# EasyEDA Pro project ProPrj_AUCompetition.epro, schematic 扩展板

## Sheets
1 P1: Assembly Variant: Basic; Board Name: Board1; Create Date: 2026-05-09; Page Name: P1; Project Name: 21届智控大赛; Schematic Name: Schematic1; Update Date: 2026-05-09; BladeWidth: 10; Company: 嘉立创EDA; Page Size: A4; RegionStart: 1; ShowBorder: 1; TitleBlock: 1; TitleBlockPosition: 3; Version: V1.0; XRegionCount: 6; YRegionCount: 4
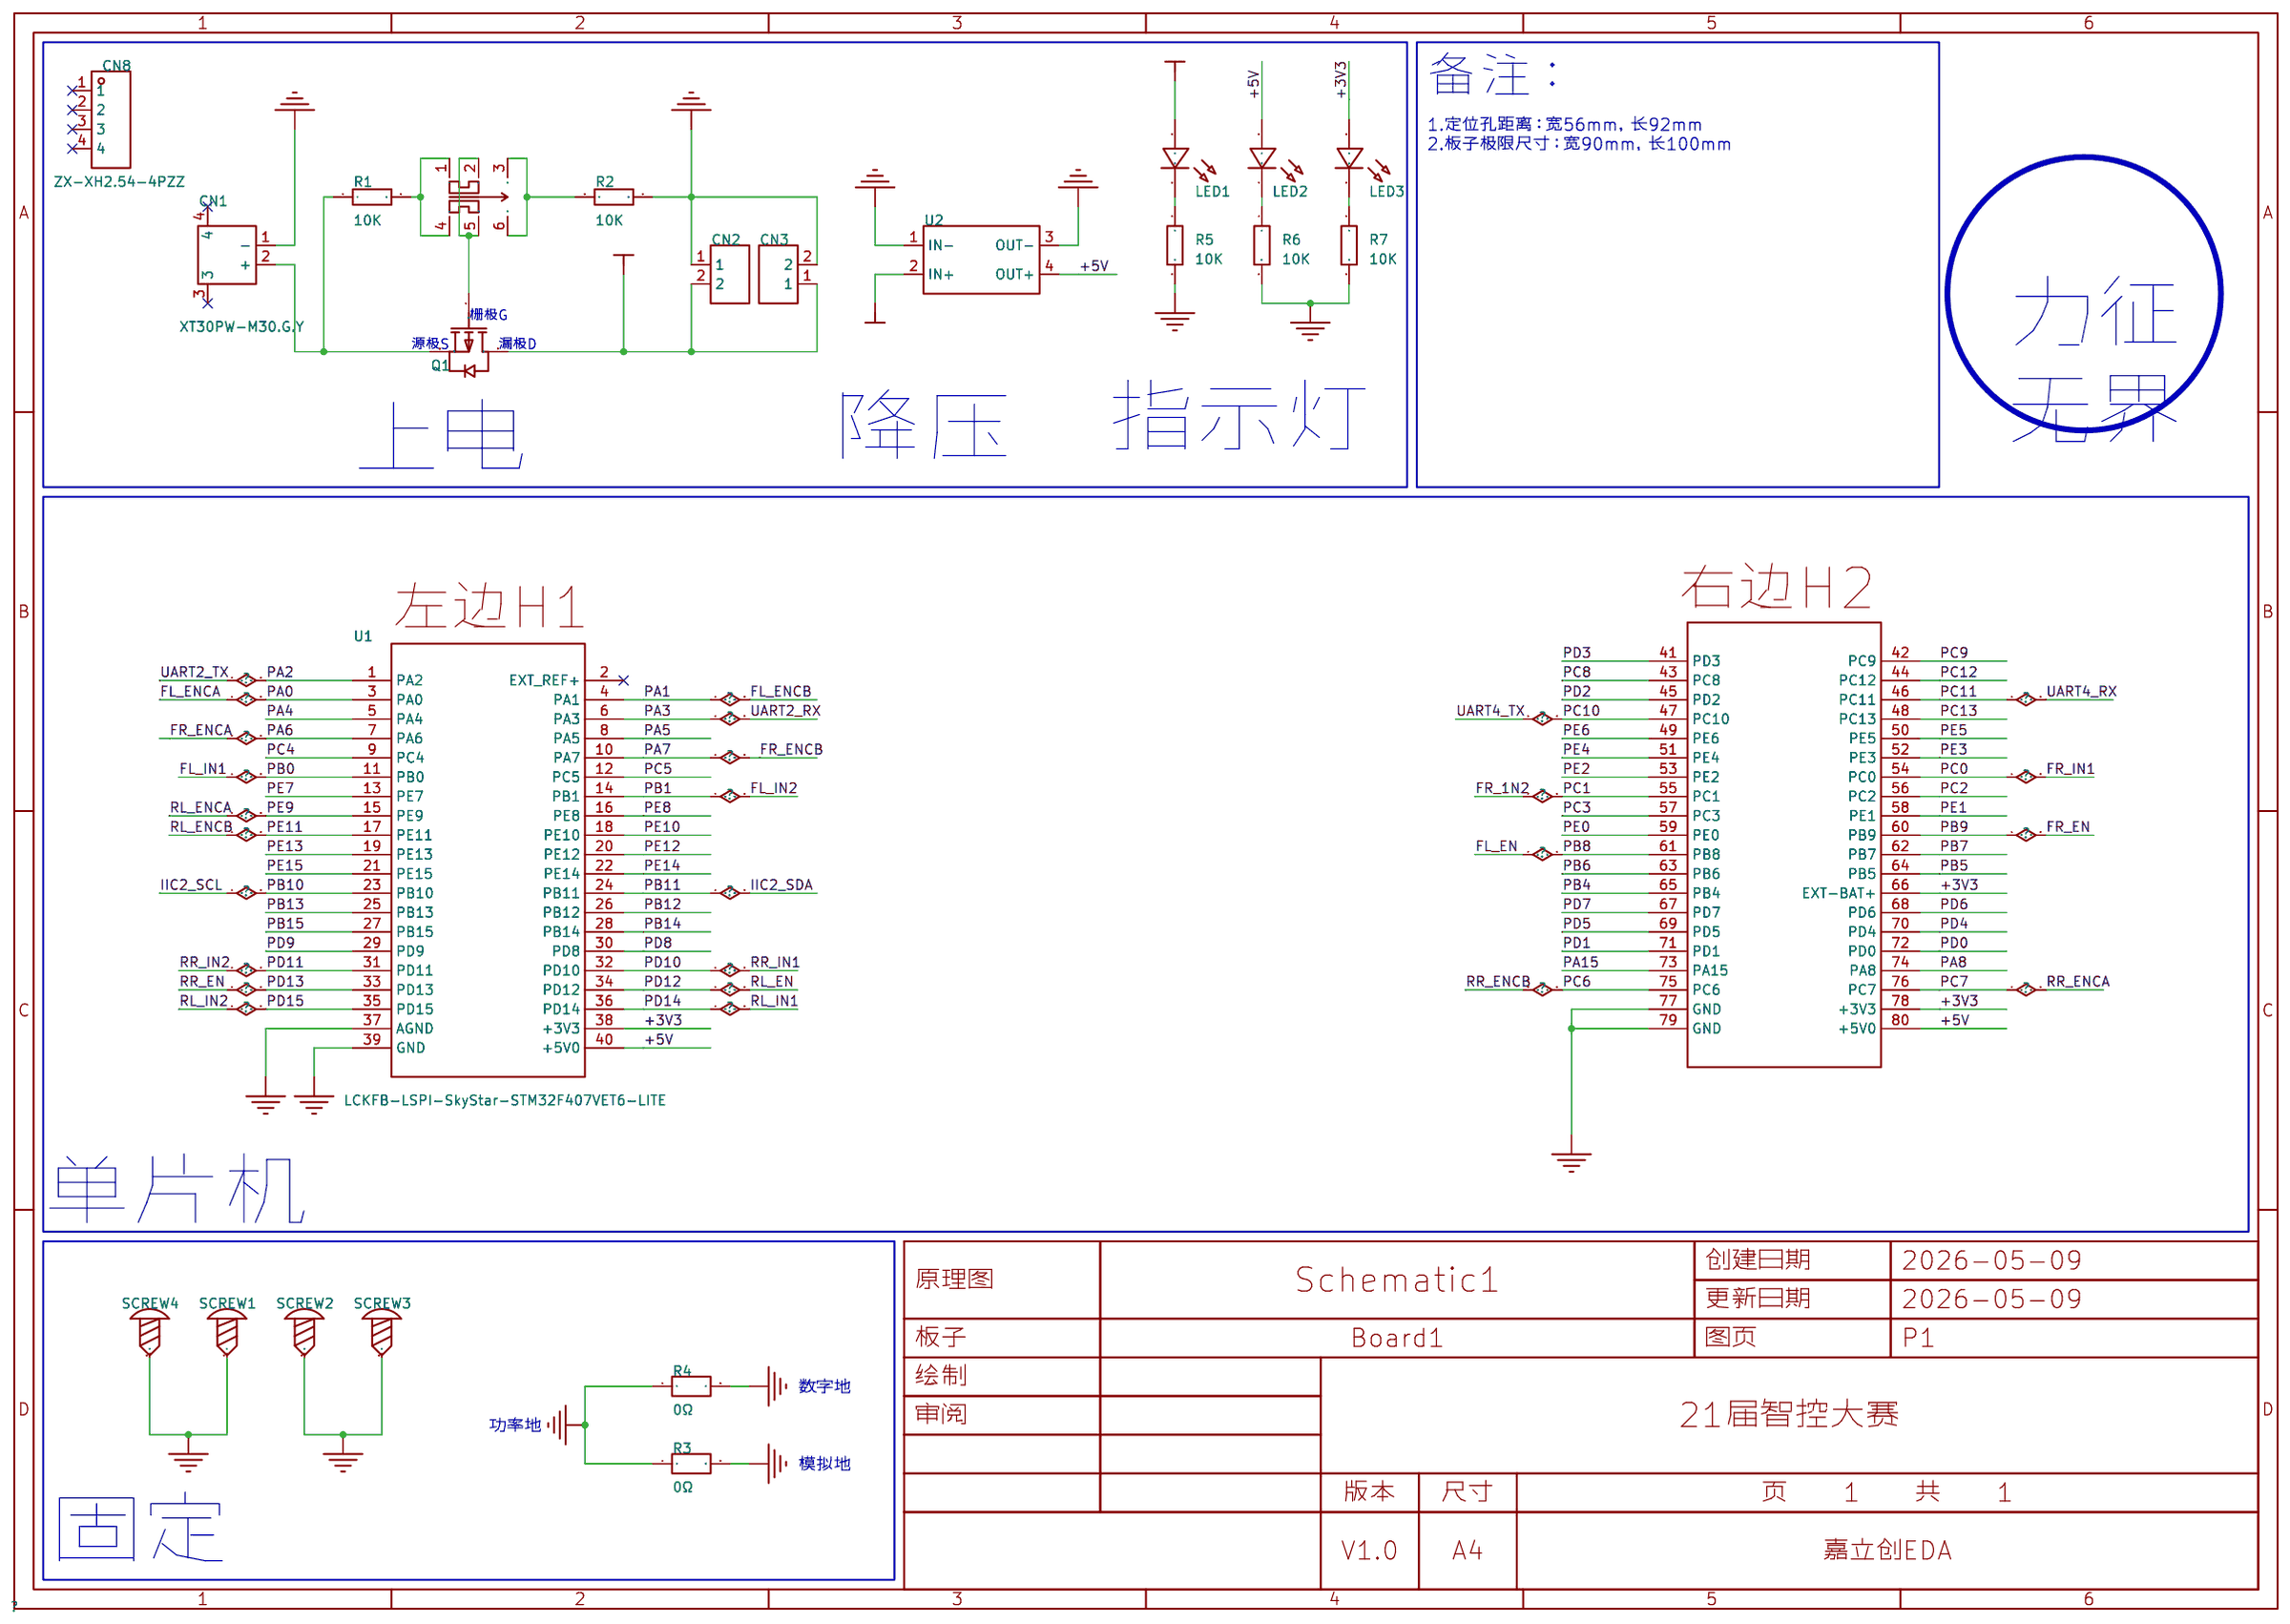
[diagram p0: P1]
2 P2: Board Name: 主控v2; Page Name: P2; Schematic Name: 扩展板
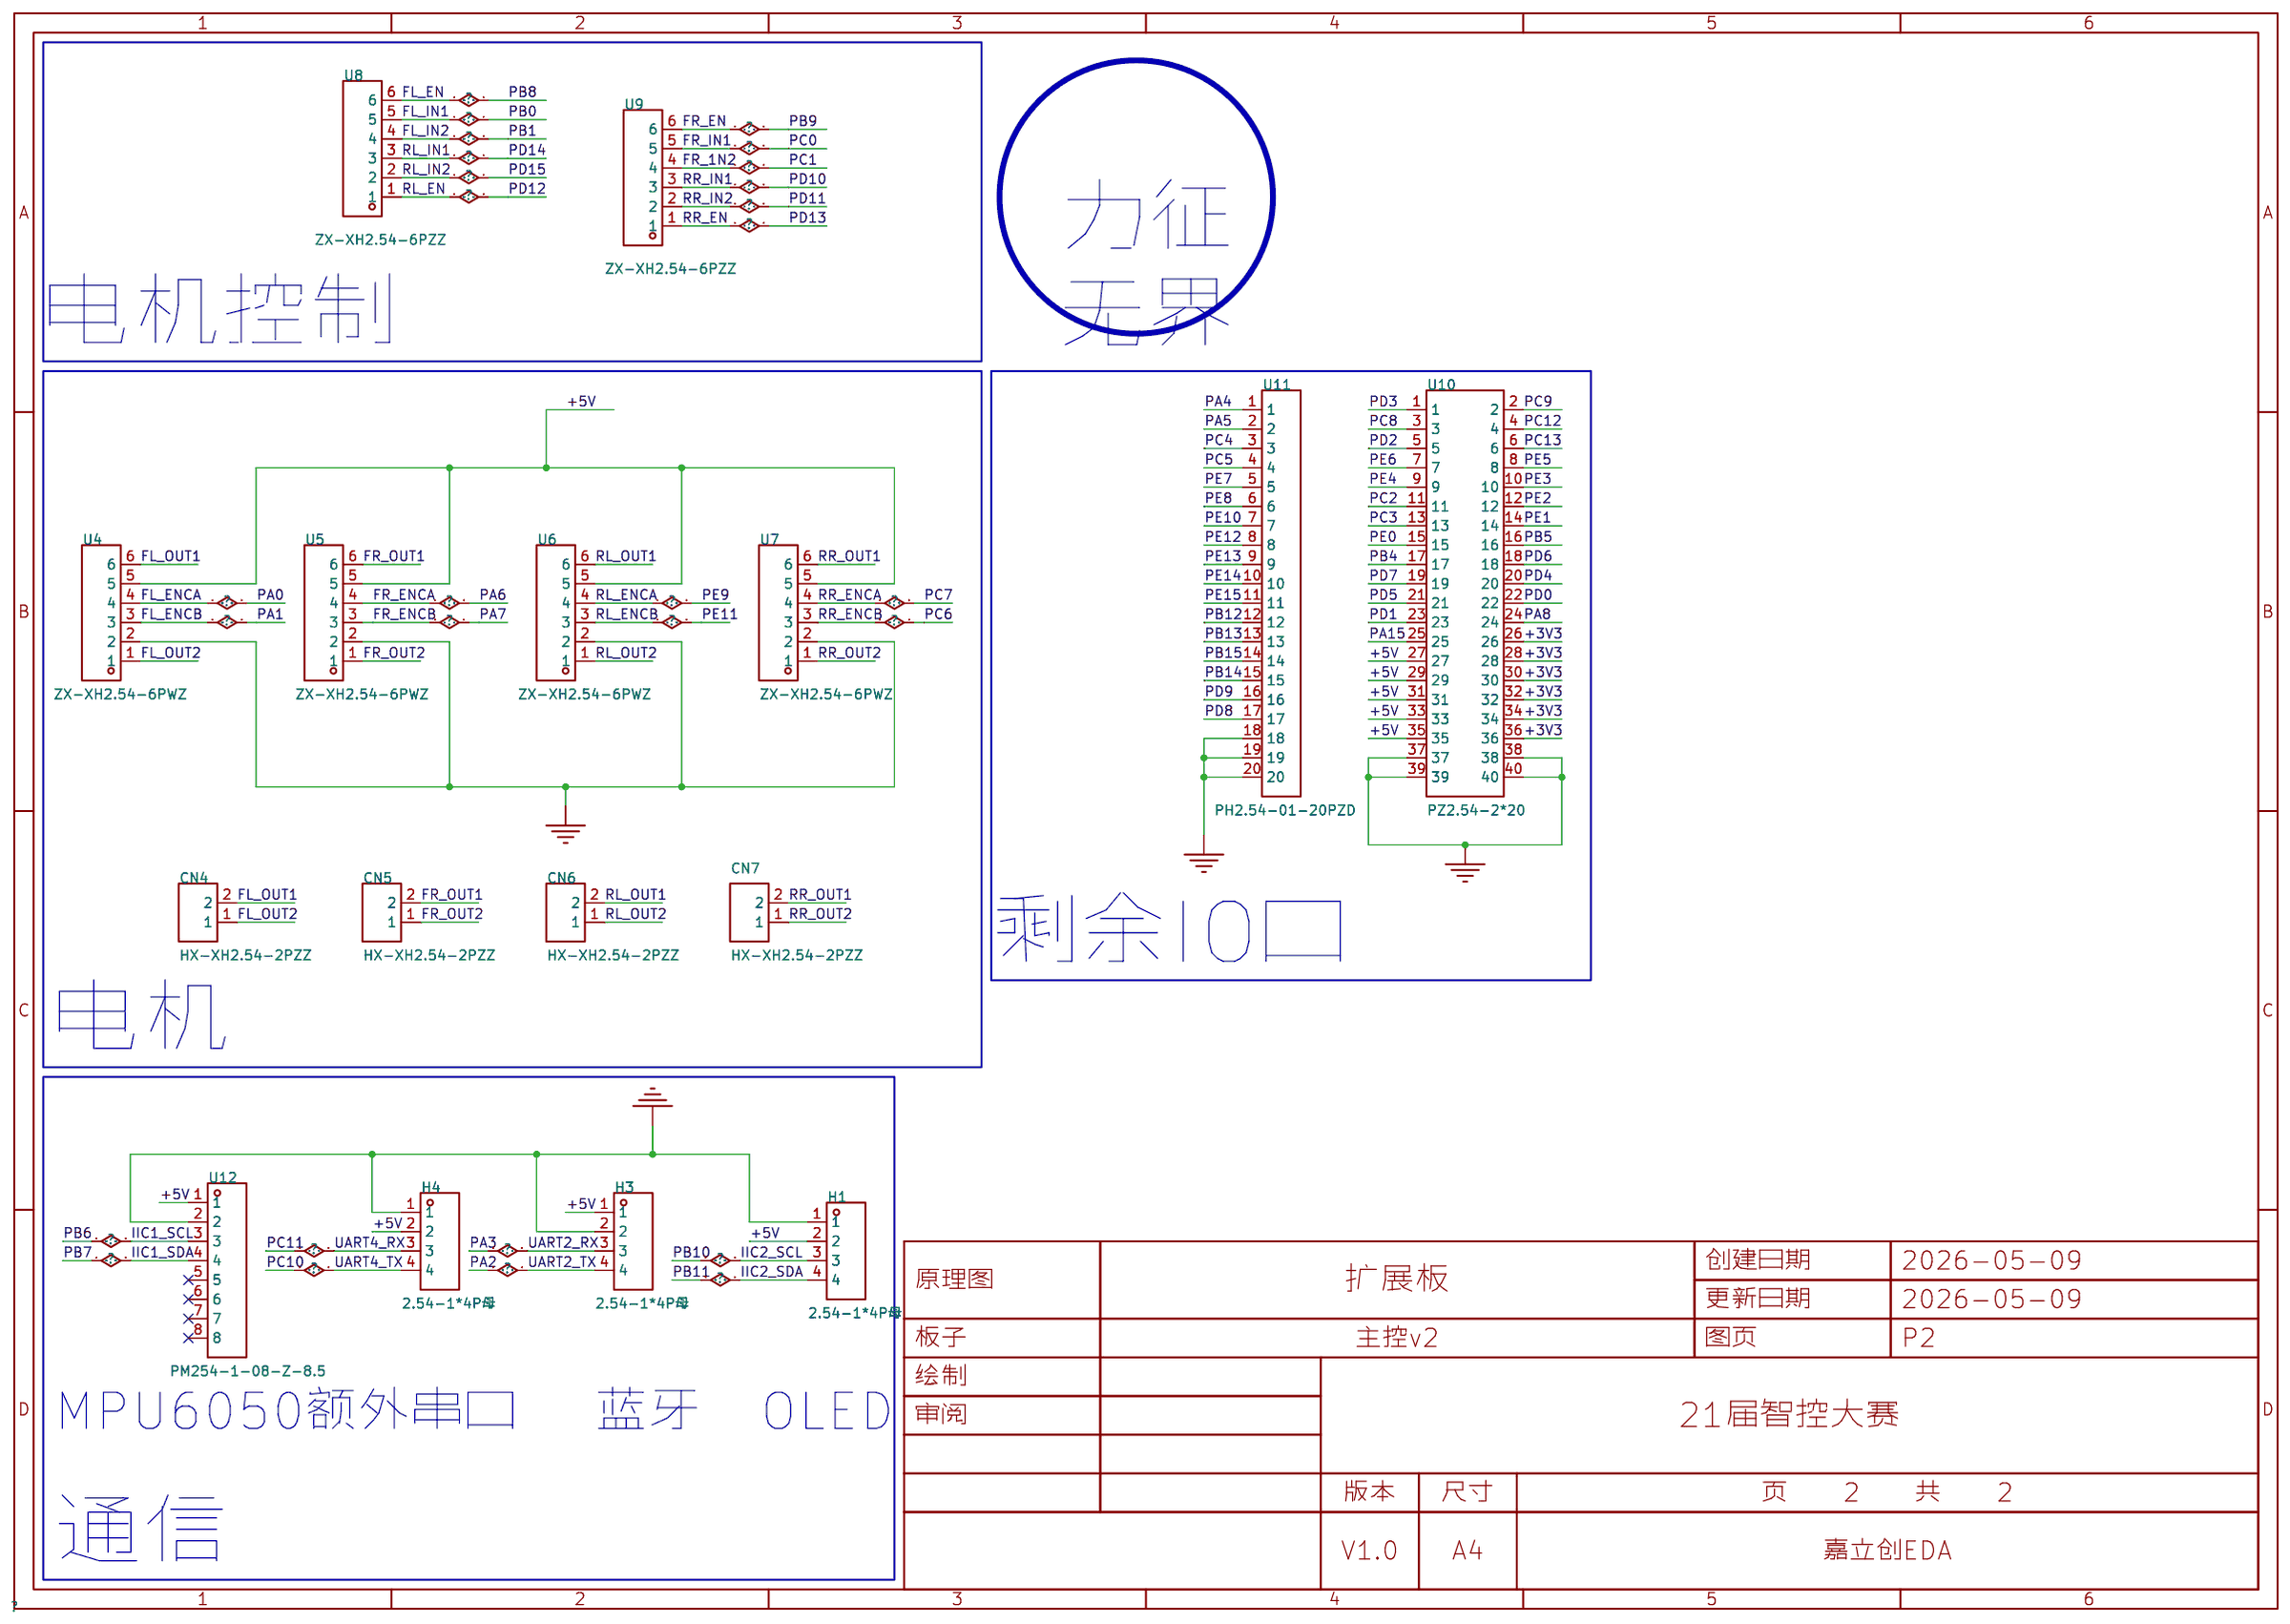
[diagram p1: P2]

## Parts
sheet P1
CN1  XT30PW-M30.G.Y  [CONN-TH_XT30PW-M]
CN2  HX-XH2.54-2PZZ  [CONN-TH_2P-P2.50_HX-2.54MM-2P-ZZ-MS]
CN3  HX-XH2.54-2PZZ  [CONN-TH_2P-P2.50_HX-2.54MM-2P-ZZ-MS]
CN8  ZX-XH2.54-4PZZ  [CONN-TH_4P-P2.50_4PIN]
LED1  -  [LED_0805]
LED2  -  [LED_0805]
LED3  -  [LED_0805]
Q1  AOD409  [TO-252-2_L6.6-W6.1-P4.57-LS9.9-TL-CW]
R1  10K  [R0805]
R2  10K  [R0805]
R3  0Ω  [R1206]
R4  0Ω  [R1206]
R5  10K  [R0805]
R6  10K  [R0805]
R7  10K  [R0805]
SCREW1  -  [M3螺丝]
SCREW2  -  [M3螺丝]
SCREW3  -  [M3螺丝]
SCREW4  -  [M3螺丝]
U1  LCKFB-LSPI-SkyStar-STM32F407VET6-LITE  [COMM-TH_LCKFB-LSPI-SKYSTAR-STM32F407VET6-LITE]
U2  -  [DCE001]
U3  YSSP2AG00  [SW-SMD_YSSP2AG00]
sheet P2
CN4  HX-XH2.54-2PZZ  [CONN-TH_2P-P2.50_HX-2.54MM-2P-ZZ-MS]
CN5  HX-XH2.54-2PZZ  [CONN-TH_2P-P2.50_HX-2.54MM-2P-ZZ-MS]
CN6  HX-XH2.54-2PZZ  [CONN-TH_2P-P2.50_HX-2.54MM-2P-ZZ-MS]
CN7  HX-XH2.54-2PZZ  [CONN-TH_2P-P2.50_HX-2.54MM-2P-ZZ-MS]
H1  2.54-1*4P母  [HDR-TH_4P-P2.54-V-F]
H3  2.54-1*4P母  [HDR-TH_4P-P2.54-V-F]
H4  2.54-1*4P母  [HDR-TH_4P-P2.54-V-F]
U4  ZX-XH2.54-6PWZ  [CONN-TH_6P-P2.50_ZX-XH2.54-6PWZ]
U5  ZX-XH2.54-6PWZ  [CONN-TH_6P-P2.50_ZX-XH2.54-6PWZ]
U6  ZX-XH2.54-6PWZ  [CONN-TH_6P-P2.50_ZX-XH2.54-6PWZ]
U7  ZX-XH2.54-6PWZ  [CONN-TH_6P-P2.50_ZX-XH2.54-6PWZ]
U8  ZX-XH2.54-6PZZ  [CONN-TH_6P-P2.50_ZX-XH2.54-6PZZ]
U9  ZX-XH2.54-6PZZ  [CONN-TH_6P-P2.50_ZX-XH2.54-6PZZ]
U10  PZ2.54-2*20  [HDR-TH_40P-P2.54-V-M-R2-C20-S2.54]
U11  PH2.54-01-20PZD  [HDR-TH_20P-P2.54-V-M-4]
U12  PM254-1-08-Z-8.5  [HDR-TH_8P-P2.54-V-F]

## Library data of the parts
CN1 = XT30PW-M30.G.Y: Socket,DCsupply,XT30,male,PIN:2; LCSC Part Name: AMASS(艾迈斯)航模插头电调机插座锂电池连接器 PCB板卧式 公头XT30PW-M30.G.Y; Supplier Part: C431092; Manufacturer: AMASS(艾迈斯); JLCPCB Part Class: Extended Part; Datasheet: https://item.szlcsc.com/datasheet/XT30PW-M30.G.Y/426930.html; Supplier: LCSC; Rated current: 15A; Rated voltage: 500VDC; Connector type: 航模插头; Wire gauge: 16/18/20AWG; contact resistance: 1.2mΩ; Size/Specification: 2pin; interface form: 公头
CN2-CN7 = HX-XH2.54-2PZZ: 插针结构:1x2P;间距:2.54mm;安装方式:直插;参考系列:XH;总PIN数:2P;排数:1;每排PIN数:2;行距:-;额定电流:3A;触头材质:黄铜;触头镀层:锡;工作温度:-25℃~+85℃;; LCSC Part Name: 1x2P 间距:2.5mm 直插 系列:XH; Supplier Part: C42391660; Manufacturer: hanxia(韩下); Supplier Footprint: 插件,P=2.5mm; JLCPCB Part Class: Extended Part; Datasheet: https://item.szlcsc.com/datasheet/HX-XH2.54-2PZZ/44326932.html; Supplier: LCSC; Pins Structure: 1x2P; Pitch: 2.54mm; Mounting Type: 直插; Reference Series: XH; Number of Pins: 2P; Number of Rows: 1; Number of PINs Per Row: 2; Current Rating: 3A; Contact Material: 黄铜; Contact Plating: 锡; Operating Temperature: -25℃~+85℃; Voltage Rating: 250V; Plastic Material: PA66; Flame Retardant Rating: UL94V-0; Color: 白色
CN8 = ZX-XH2.54-4PZZ: 插针结构:1x4P;间距:2.5mm;安装方式:直插;参考系列:XH;总PIN数:4P;排数:1;每排PIN数:4;行距:-;额定电流:3A;触头材质:黄铜;触头镀层:锡;工作温度:-25℃~+85℃;; LCSC Part Name: 1x4P 间距:2.5mm 直插 系列:XH; Supplier Part: C7429634; Manufacturer: Megastar(兆星); Supplier Footprint: 插件,P=2.5mm; JLCPCB Part Class: Extended Part; Datasheet: https://item.szlcsc.com/datasheet/ZX-XH2.54-4PZZ/8427551.html; Supplier: LCSC; Pins Structure: 1x4P; Pitch: 2.5mm; Mounting Type: 直插; Reference Series: XH; Number of Pins: 4P; Number of Rows: 1; Number of PINs Per Row: 4; Current Rating: 3A; Contact Material: 黄铜; Contact Plating: 锡; Operating Temperature: -25℃~+85℃; Voltage Rating: 250V; Plastic Material: PA66; Flame Retardant Rating: UL94V-0; Color: 白色; Z-Height of the Board: 7mm; X-Length of Bottom Edge on Board (Spacing Line): 12.5mm; Y-Width of Bottom Edge on Board: 5.9mm
LED1-LED3 = LED_0805-B: Supplier Footprint: 0805
Q1 = AOD409_C36220: 数量:1个P沟道;漏源电压(Vdss):60V;连续漏极电流(Id):26A;导通电阻(RDS(on)):40mΩ@10V;耗散功率(Pd):-;阈值电压(Vgs(th)):2.4V@250uA;; LCSC Part Name: 1个P沟道 耐压:60V 电流:26A; Supplier Part: C36220; Manufacturer: AOS; Supplier Footprint: TO-252-2(DPAK); JLCPCB Part Class: Extended Part; Datasheet: https://item.szlcsc.com/datasheet/AOD409/37198.html; Supplier: LCSC; Number: 1个P沟道; Drain to Source Voltage: 60V; Current - Continuous Drain(Id): 26A; RDS(on): 40mΩ@10V; Gate Threshold Voltage (Vgs(th)): 2.4V@250uA; Gate Charge(Qg): 54nC@10V; Input Capacitance(Ciss): 3.6nF; Reverse Transfer Capacitance (Crss@Vds): 153pF@30V; Operating Temperature: -55℃~+175℃; Type: P沟道
R1 R2 R5-R7 = Res_0805: Supplier Footprint: 0805
R3 R4 = JER1206F1R000: 电阻类型:采样电阻;阻值:0Ω;精度:±1%;功率:1W;温度系数:±50ppm/℃;; LCSC Part Name: 0Ω 1W 1206 ±1%; Supplier Part: C49164949; Manufacturer: JIERR(捷而瑞); Supplier Footprint: 1206; JLCPCB Part Class: 扩展库; Datasheet: https://item.szlcsc.com/datasheet/JER1206F1R000/51553084.html; Supplier: LCSC; Type: 采样电阻; Tolerance: ±1%; Power(Watts): 1W; Temperature Coefficient: ±50ppm/℃
SCREW1-SCREW4 = M3螺丝: Supplier Footprint: 插件
U1 = LCKFB-LSPI-SkyStar-STM32F407VET6-LITE: 单板,不送排针; LCSC Part Name: 立创·天空星开发板-STM32F407VET6-青春版; Supplier Part: C22370035; Manufacturer: 立创开发板; JLCPCB Part Class: Extended Part; Datasheet: https://item.szlcsc.com/datasheet/LCKFB-LSPI-SkyStar-STM32F407VET6-LITE/23849165.html; Supplier: LCSC
U2 = DCE001: DCE001mini板降压模块
U3 = YSSP2AG00: LCSC Part Name: 9x3.6 正按6脚贴片滑动开关; Supplier Part: C5188558; Manufacturer: YIYUAN(怡远); Supplier Footprint: SMD; JLCPCB Part Class: Extended Part; Datasheet: https://atta.szlcsc.com/upload/public/pdf/source/20221011/AF6FF47B5A85181594B051FD518E9363.pdf; Supplier: LCSC
H1 H3 H4 = 2.54-1*4P母: 插孔结构:1x4P;间距:2.54mm;行距:-;圆孔/方孔:方孔;安装方式:直插;排数:单排;总孔位数:4P;额定电流:3A;额定电压:-;插孔方向:顶部;塑高:-;触头材质:青铜;触头镀层:-;工作温度:-40℃~+105℃;; LCSC Part Name: 间距:2.54mm 1x4P 直插; Supplier Part: C2718488; Manufacturer: BOOMELE(博穆精密); Supplier Footprint: 插件,P=2.54mm; JLCPCB Part Class: Extended Part; Datasheet: https://item.szlcsc.com/datasheet/2.54-1*4P%25E6%25AF%258D/2834502.html; Supplier: LCSC; Holes Structure: 1x4P; Pitch: 2.54mm; Circular Hole / Square Hole: 方孔; Mounting Type: 直插; Number of Rows: 单排; Number of Positions: 4P; Current Rating: 3A; Holes Direction: 顶部; Contact Material: 青铜; Operating Temperature: -40℃~+105℃
U4-U7 = ZX-XH2.54-6PWZ: 插针结构:1x6P;间距:2.5mm;安装方式:弯插;参考系列:XH;总PIN数:6P;排数:1;每排PIN数:6;行距:-;额定电流:2A;触头材质:黄铜;触头镀层:锡;工作温度:-25℃~+85℃;; LCSC Part Name: 1x6P 间距:2.5mm 弯插 系列:XH; Supplier Part: C7429645; Manufacturer: Megastar(兆星); Supplier Footprint: 弯插,P=2.5mm; JLCPCB Part Class: Extended Part; Datasheet: https://item.szlcsc.com/datasheet/ZX-XH2.54-6PWZ/8427562.html; Supplier: LCSC; Pins Structure: 1x6P; Pitch: 2.5mm; Mounting Type: 弯插; Reference Series: XH; Number of Pins: 6P; Number of Rows: 1; Number of PINs Per Row: 6; Current Rating: 2A; Contact Material: 黄铜; Contact Plating: 锡; Operating Temperature: -25℃~+85℃; Voltage Rating: 250V; Plastic Material: PA66; Flame Retardant Rating: UL94V-0; Color: 白色; Z-Height of the Board: 5.9mm; X-Length of Bottom Edge on Board (Spacing Line): 17.5mm; Y-Width of Bottom Edge on Board: 7.32mm
U8 U9 = ZX-XH2.54-6PZZ: 插针结构:1x6P;间距:2.5mm;安装方式:直插;参考系列:XH;总PIN数:6P;排数:1;每排PIN数:6;行距:-;额定电流:3A;触头材质:黄铜;触头镀层:锡;工作温度:-25℃~+85℃;; LCSC Part Name: 1x6P 间距:2.5mm 直插 系列:XH; Supplier Part: C7429636; Manufacturer: Megastar(兆星); Supplier Footprint: 插件,P=2.5mm; JLCPCB Part Class: Extended Part; Datasheet: https://item.szlcsc.com/datasheet/ZX-XH2.54-6PZZ/8427553.html; Supplier: LCSC; Pins Structure: 1x6P; Pitch: 2.5mm; Mounting Type: 直插; Reference Series: XH; Number of Pins: 6P; Number of Rows: 1; Number of PINs Per Row: 6; Current Rating: 3A; Contact Material: 黄铜; Contact Plating: 锡; Operating Temperature: -25℃~+85℃; Voltage Rating: 250V; Plastic Material: PA66; Flame Retardant Rating: UL94V-0; Color: 白色; Z-Height of the Board: 7mm; X-Length of Bottom Edge on Board (Spacing Line): 17.5mm; Y-Width of Bottom Edge on Board: 5.9mm
U10 = PZ2.54-2*20: 插针结构:2x20P;间距:2.54mm;行距:2.54mm;圆针/方针:方针;安装方式:直插;排数:双排;总PIN位数:40P;额定电流:2.5A;配合针长度:6mm;塑高:2.54mm;端接针长度:3mm;触头材质:黄铜;触头镀层:金;工作温度:-40℃~+105℃;; LCSC Part Name: 2x20P 间距:2.54mm 方针 直插; Supplier Part: C5224014; Manufacturer: ZHOURI(洲日); Supplier Footprint: 插件,P=2.54mm; JLCPCB Part Class: Extended Part; Datasheet: https://item.szlcsc.com/datasheet/PZ2.54-2*20/5925193.html; Supplier: LCSC; Pin Structure: 2x20P; Pitch: 2.54mm; Row Spacing: 2.54mm; Circluar Pins/Square Pins: 方针; Mounting Type: 直插; Number of Rows: 双排; Number of Pins: 40P; Current Rating: 2.5A; Length of Mating Pin: 6mm; Insulation Height: 2.54mm; Length of End Connection Pin: 3mm; Contact Material: 黄铜; Contact Plating: 金; Operating Temperature: -40℃~+105℃
U11 = PH2.54-01-20PZD: 插针结构:1x20P;间距:2.54mm;圆针/方针:方针;安装方式:直插;排数:单排;总PIN位数:20P;额定电流:3A;配合针长度:6mm;塑高:2.5mm;端接针长度:3mm;触头材质:黄铜;触头镀层:金;工作温度:-40℃~+105℃;颜色:黑色;; LCSC Part Name: 1x20P 间距:2.54mm 方针 直插; Supplier Part: C7501591; Manufacturer: XUNPU(讯普); Supplier Footprint: 插件,P=2.54mm; JLCPCB Part Class: Extended Part; Datasheet: https://item.szlcsc.com/datasheet/PH2.54-01-20PZD/8584145.html; Supplier: LCSC; Pin Structure: 1x20P; Pitch: 2.54mm; Circluar Pins/Square Pins: 方针; Mounting Type: 直插; Number of Rows: 单排; Number of Pins: 20P; Current Rating: 3A; Length of Mating Pin: 6mm; Insulation Height: 2.5mm; Length of End Connection Pin: 3mm; Contact Material: 黄铜; Contact Plating: 金; Operating Temperature: -40℃~+105℃; Color: 黑色
U12 = PM254-1-08-Z-8.5: 插孔结构:1x8P;间距:2.54mm;行距:-;圆孔/方孔:方孔;安装方式:直插;排数:单排;总孔位数:8P;额定电流:3A;额定电压:-;插孔方向:顶部;塑高:8.5mm;触头材质:铜合金;工作温度:-40℃~+105℃;; LCSC Part Name: 1x8P 间距:2.54mm 直插; Supplier Part: C2897371; Manufacturer: HCTL(华灿天禄); Supplier Footprint: 插件,P=2.54mm; JLCPCB Part Class: Extended Part; Datasheet: https://item.szlcsc.com/datasheet/PM254-1-08-Z-8.5/3142376.html; Supplier: LCSC; Holes Structure: 1x8P; Pitch: 2.54mm; Circular Hole / Square Hole: 方孔; Mounting Type: 直插; Number of Rows: 单排; Number of Positions: 8P; Current Rating: 3A; Holes Direction: 顶部; Insulation Height: 8.5mm; Contact Material: 铜合金; Operating Temperature: -40℃~+105℃

## Nets
+3V3: LED3.2(A) U1.38(+3V3) U1.66(EXT-BAT+) U1.78(+3V3) U10.26 U10.28 U10.30 U10.32 U10.34 U10.36
+5V: H1.2 H3.1 H4.2 LED2.2(A) U1.40(+5V0) U1.80(+5V0) U2.4(OUT+) U4.5 U5.5 U6.5 U7.5 U10.27 U10.29 U10.31 U10.33 U10.35 U12.1
AGND: R3.2 U1.37(AGND)
DGND: H1.1 H3.2 H4.1 R4.2 R6.2 R7.2 SCREW1.1 SCREW4.1 U1.39(GND) U1.77(GND) U1.79(GND) U2.3(OUT-) U4.2 U5.2 U6.2 U7.2 U10.37 U10.38 U10.39 U10.40 U11.18 U11.19 U11.20 U12.2
PGND: CN1.1(-) CN2.1 CN3.2 R2.1 R3.1 R4.1 R5.2 SCREW2.1 SCREW3.1 U2.1(IN-)
VIN: CN2.2 CN3.1 LED1.2(A) Q1.2(D) U2.2(IN+)
FL_EN: U1.61(PB8) U8.6
FL_ENCA: U1.3(PA0) U4.4
FL_ENCB: U1.4(PA1) U4.3
FL_IN1: U1.11(PB0) U8.5
FL_IN2: U1.14(PB1) U8.4
FL_OUT1: CN4.2 U4.6
FL_OUT2: CN4.1 U4.1
FR_1N2: U1.55(PC1) U9.4
FR_EN: U1.60(PB9) U9.6
FR_ENCA: U1.7(PA6) U5.4
FR_ENCB: U1.10(PA7) U5.3
FR_IN1: U1.54(PC0) U9.5
FR_OUT1: CN5.2 U5.6
FR_OUT2: CN5.1 U5.1
IIC1_SCL: U1.63(PB6) U12.3
IIC1_SDA: U1.62(PB7) U12.4
IIC2_SCL: H1.3 U1.23(PB10)
IIC2_SDA: H1.4 U1.24(PB11)
PA2: H3.4 U1.1(PA2)
PA3: H3.3 U1.6(PA3)
PA4: U1.5(PA4) U11.1
PA5: U1.8(PA5) U11.2
PA8: U1.74(PA8) U10.24
PA15: U1.73(PA15) U10.25
PB4: U1.65(PB4) U10.17
PB5: U1.64(PB5) U10.16
PB12: U1.26(PB12) U11.12
PB13: U1.25(PB13) U11.13
PB14: U1.28(PB14) U11.15
PB15: U1.27(PB15) U11.14
PC2: U1.56(PC2) U10.11
PC3: U1.57(PC3) U10.13
PC4: U1.9(PC4) U11.3
PC5: U1.12(PC5) U11.4
PC6: U1.75(PC6) U7.3
PC7: U1.76(PC7) U7.4
PC8: U1.43(PC8) U10.3
PC9: U1.42(PC9) U10.2
PC10: H4.4 U1.47(PC10)
PC11: H4.3 U1.46(PC11)
PC12: U1.44(PC12) U10.4
PC13: U1.48(PC13) U10.6
PD0: U1.72(PD0) U10.22
PD1: U1.71(PD1) U10.23
PD2: U1.45(PD2) U10.5
PD3: U1.41(PD3) U10.1
PD4: U1.70(PD4) U10.20
PD5: U1.69(PD5) U10.21
PD6: U1.68(PD6) U10.18
PD7: U1.67(PD7) U10.19
PD8: U1.30(PD8) U11.17
PD9: U1.29(PD9) U11.16
PD10: U1.32(PD10) U9.3
PD11: U1.31(PD11) U9.2
PD12: U1.34(PD12) U8.1
PD13: U1.33(PD13) U9.1
PD14: U1.36(PD14) U8.3
PD15: U1.35(PD15) U8.2
PE0: U1.59(PE0) U10.15
PE1: U1.58(PE1) U10.14
PE2: U1.53(PE2) U10.12
PE3: U1.52(PE3) U10.10
PE4: U1.51(PE4) U10.9
PE5: U1.50(PE5) U10.8
PE6: U1.49(PE6) U10.7
PE7: U1.13(PE7) U11.5
PE8: U1.16(PE8) U11.6
PE9: U1.15(PE9) U6.4
PE10: U1.18(PE10) U11.7
PE11: U1.17(PE11) U6.3
PE12: U1.20(PE12) U11.8
PE13: U1.19(PE13) U11.9
PE14: U1.22(PE14) U11.10
PE15: U1.21(PE15) U11.11
RL_OUT1: CN6.2 U6.6
RL_OUT2: CN6.1 U6.1
RR_OUT1: CN7.2 U7.6
RR_OUT2: CN7.1 U7.1
$1N204: CN1.2(+) Q1.3(S) R1.1
$1N206: R1.2 U3.1 U3.4
$1N208: Q1.1(G) U3.2 U3.5
$1N209: R2.2 U3.3 U3.6
$1N243: LED1.1(C) R5.1
$1N244: LED2.1(C) R6.1
$1N245: LED3.1(C) R7.1

Not connected (* = marked no-connect by the designer): CN1 3* 4*; CN8 1* 2* 3* 4*; U1 2(EXT REF+)*; U12 5* 6* 7* 8*

## Notes on the sheets
sheet 1
- 备注：
- 1.定位孔距离：宽56mm，长92mm
  2.板子极限尺寸：宽90mm，长100mm
- 力征
  无界
- 栅极G
- 源极S
- 漏极D
- 指示灯
- 上电
- 降压
- 单片机
- 数字地
- 功率地
- 模拟地
- 固定
sheet 2
- 力征
  无界
- 电机控制
- 剩余IO口
- 电机
- MPU6050
- 额外串口
- 蓝牙
- OLED
- 通信
